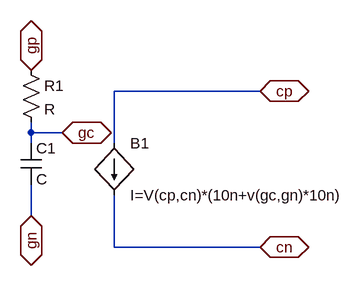
[diagram p0: schematic symb_capteur.asc]
symb_capteur.asc, the LTspice schematic file:
Version 4
SHEET 1 880 680
WIRE 304 32 80 32
WIRE -48 96 -48 80
WIRE 0 96 -48 96
WIRE -48 112 -48 96
WIRE 80 112 80 32
WIRE -48 224 -48 176
WIRE 80 272 80 192
WIRE 304 272 80 272
FLAG 304 32 cp
IOPIN 304 32 BiDir
FLAG 304 272 cn
IOPIN 304 272 BiDir
FLAG -48 0 gp
IOPIN -48 0 BiDir
FLAG -48 224 gn
IOPIN -48 224 BiDir
FLAG 0 96 gc
IOPIN 0 96 BiDir
SYMBOL bi 80 112 R0
SYMATTR InstName B1
SYMATTR Value I=V(cp,cn)*(10n+v(gc,gn)*10n)
SYMBOL cap -64 112 R0
SYMATTR InstName C1
SYMBOL res -64 -16 R0
SYMATTR InstName R1

The netlist it stands for:
* symb_capteur.asc
B1 cp cn I=V(cp,cn)*(10n+v(gc,gn)*10n)
C1 gc gn C
R1 gp gc R
.backanno
.end